# Altium schematic sheet Sheet4.SchDoc: =GlobalProjectName
size 209 x 297 mm; ApprovedBy: Утвердил; CheckedBy: Проверил; Author: Разработал; SheetNumber: 53; SheetTotal: 66; PageSetup: Record=PageOptions|CenterHorizontal=True|CenterVertical=True|PrintScale=1.00|XCorrection=1.00|YCorrection=1.00|PrintKind=1|BorderSize=5000000|LeftOffset=0|BottomOffset=0|Orientation=2|PaperLength=1000|PaperWidth=1000|Scale=100|PaperSource=15|PrintQuality=1200|MediaType=1|DitherType=10|PaperKind=A3|PrintScaleMode=1; Weight: -; ScaleFactor: -; NormInspection: Норм.Контр.
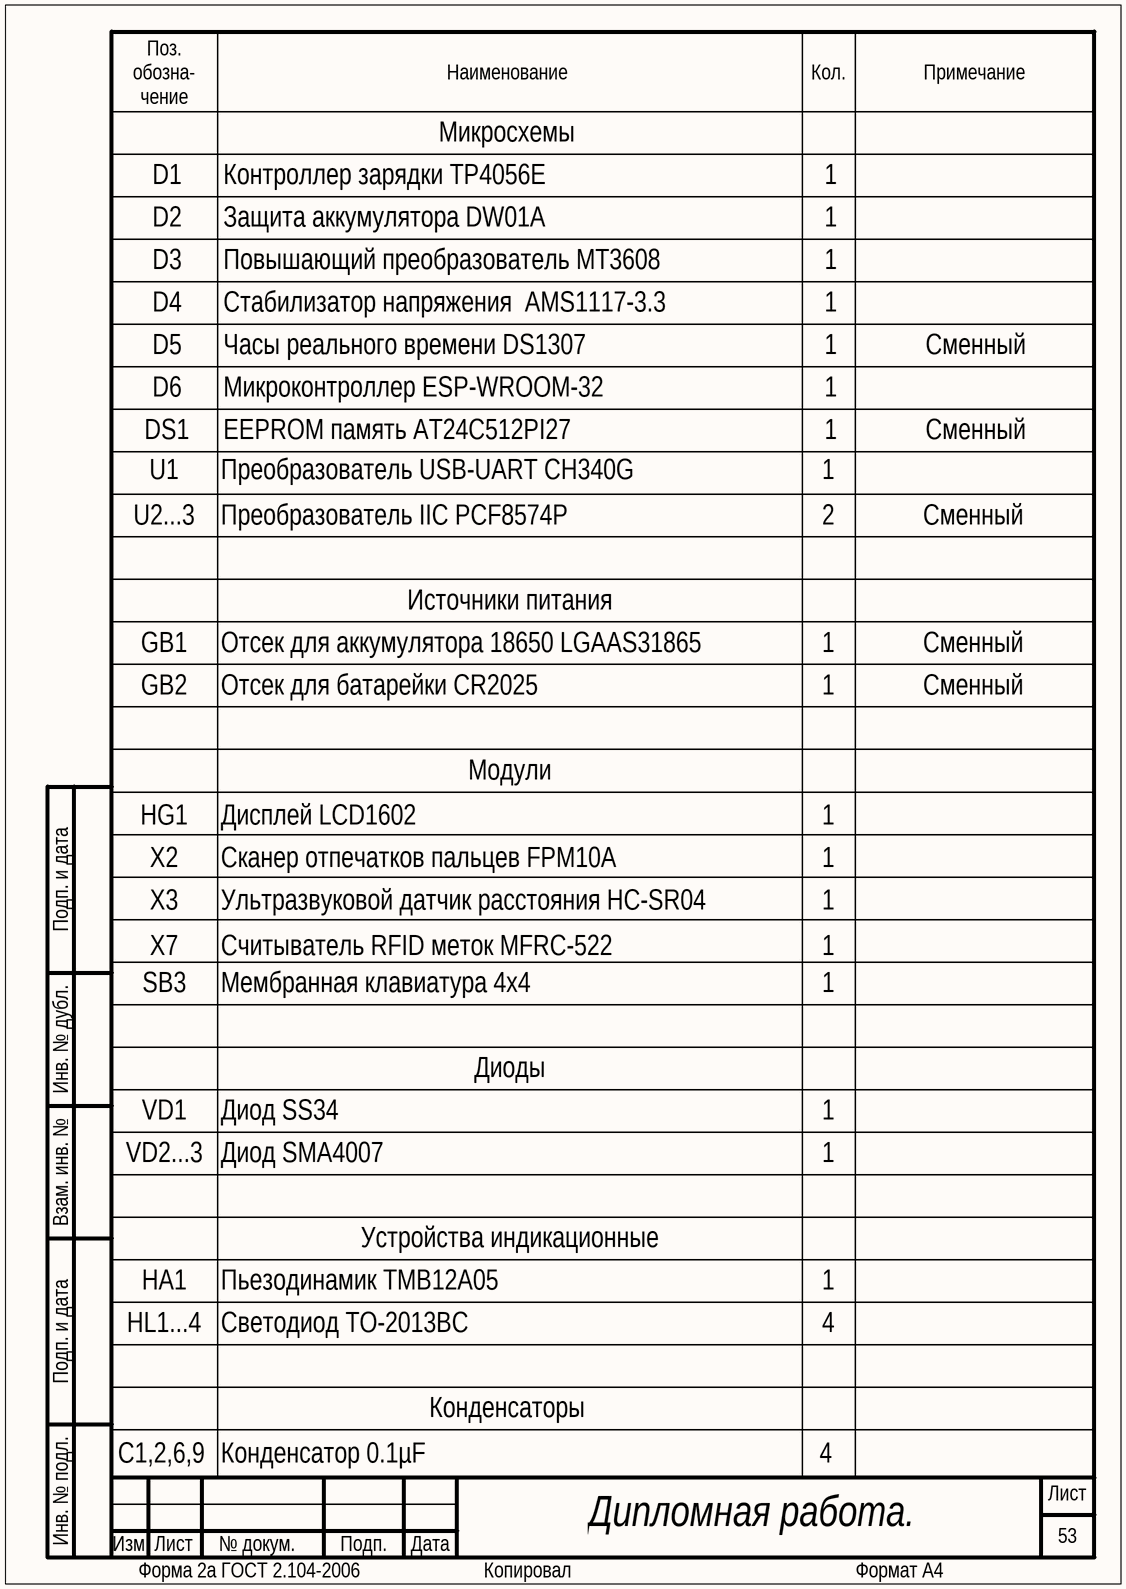
[diagram p0: Sheet4.SchDoc]

## Notes on the sheet
- D1
- Микросхемы
- Контроллер зарядки TP4056E
- 1
- D2
- Защита аккумулятора DW01A
- D3
- D4
- Повышающий преобразователь MT3608
- Стабилизатор напряжения  AMS1117-3.3
- D5
- Часы реального времени DS1307
- Сменный
- D6
- DS1
- Микроконтроллер ESP-WROOM-32
- EEPROM память AT24C512PI27
- U1
- U2...3
- Преобразователь USB-UART CH340G
- Преобразователь IIC PCF8574P
- 2
- GB1
- Источники питания
- Отсек для аккумулятора 18650 LGAAS31865
- GB2
- Отсек для батарейки CR2025
- Модули
- HG1
- Дисплей LCD1602
- X2
- X3
- Сканер отпечатков пальцев FPM10A
- Ультразвуковой датчик расстояния HC-SR04
- X7
- SB3
- Считыватель RFID меток MFRC-522
- Мембранная клавиатура 4x4
- VD1
- Диоды
- Диод SS34
- VD2...3
- Диод SMA4007
- Устройства индикационные
- HA1
- HL1...4
- Пьезодинамик TMB12A05
- Светодиод TO-2013BC
- 4
- С1,2,6,9
- Конденсаторы
- Конденсатор 0.1µF
- Дипломная работа.
- Поз.
  обозна-
  чение
- Наименование
- Кол.
- Примечание
- Подп. и дата
- Инв. № дубл.
- Взам. инв. №
- Инв. № подл.
- Изм.
- Лист
- № докум.
- Подп.
- Дата
- Форма 2а ГОСТ 2.104-2006
- Копировал
- Формат А4